# EAGLE design Powerboard (EAGLE 9.3.1)
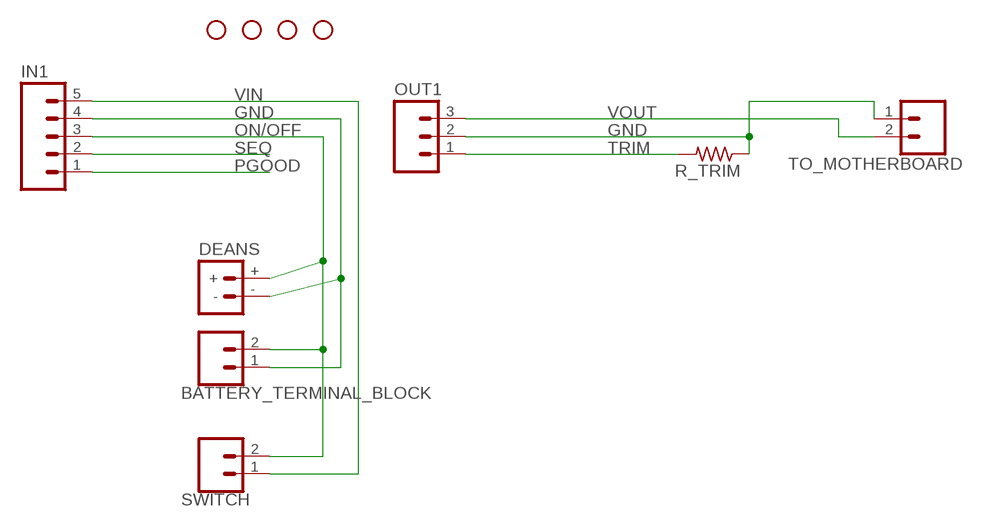
[diagram p0: schematic, sheet 1]

## Parts
BATTERY_TERMINAL_BLOCK  CONN_023.5MM  [SCREWTERMINAL-3.5MM-2]
DEANS  BATTERY_CONN_DEANS  [DEANS]
IN1  M05PTH  [1X05]
OUT1  M03PTH  [1X03]
R_TRIM  R-US_R0603  [R0603]
SWITCH  CONN_023.5MM  [SCREWTERMINAL-3.5MM-2]
TO_MOTHERBOARD  CONN_023.5MM  [SCREWTERMINAL-3.5MM-2]
U$2  STAND-OFF  [STAND-OFF]
U$6  STAND-OFF  [STAND-OFF]
U$7  STAND-OFF  [STAND-OFF]
U$8  STAND-OFF  [STAND-OFF]

## Nets
GND: BATTERY_TERMINAL_BLOCK.1 DEANS.- IN1.4 OUT1.2 R_TRIM.1 TO_MOTHERBOARD.1
ON/OFF: BATTERY_TERMINAL_BLOCK.2 DEANS.+ IN1.3 SWITCH.2
PGOOD: IN1.1
SEQ: IN1.2
TRIM: OUT1.1 R_TRIM.2
VIN: IN1.5 SWITCH.1
VOUT: OUT1.3 TO_MOTHERBOARD.2

## Library data of the parts
BATTERY_TERMINAL_BLOCK SWITCH TO_MOTHERBOARD = SparkFun-Connectors:CONN_02: Multi connection point. Often used as Generic Header-pin footprint for 0.1 inch spaced/style header connections On any of the 0.1 inch spaced packages, you can populate with these: Break Away Headers - Straight <https://www.sparkfun.com/products/116> (PRT-00116) Break Away Male Headers - Right Angle <https://www.sparkfun.com/products/553> (PRT-00553) Female Headers <https://www.sparkfun.com/products/115> (PRT-00115) Break Away Headers - Machine Pin <https://www.sparkfun.com/products/117> (PRT-00117) Break Away Female Headers - Swiss Machine Pin <https://www.sparkfun.com/products/743> (PRT-00743) For SCREWTERMINALS and SPRING TERMINALS visit here: Screw Terimnals on SparkFun.com <https://www.sparkfun.com/search/results?term=Screw+Terminals> (5mm/3.5mm/2.54mm spacing) This device is also useful as a general connection point to wire up your design to another part of your project. Our various solder wires solder well into these plated through hole pads. Hook-Up Wire - Assortment (Stranded, 22 AWG) <https://www.sparkfun.com/products/11375> (PRT-11375) Hook-Up Wire - Assortment (Solid Core, 22 AWG) <https://www.sparkfun.com/products/11367> (PRT-11367) View the entire wire category on our website here <https://www.sparkfun.com/categories/141> Special notes: Molex polarized connector foot print use with: PRT-08233 with associated crimp pins and housings. 2.54_SCREWTERM for use with PRT-10571. 3.5mm Screw Terminal footprints for PRT-08084 5mm Screw Terminal footprints for use with PRT-08432; PROD_ID: CONN-08399
DEANS = SparkFun-Connectors:BATTERY_CONN: Battery Connectors Various footprints for battery connections SparkFun Products: Deans Connector -M/F Pair <https://www.sparkfun.com/products/11864>; SF_ID: PRT-11864
IN1 = SparkFun:M05: Header 5 Standard 5-pin 0.1" header. Use with straight break away headers (SKU : PRT-00116), right angle break away headers (PRT-00553), swiss pins (PRT-00743), machine pins (PRT-00117), and female headers (PRT-00115). Molex polarized connector foot print use with SKU : PRT-08230 with associated crimp pins and housings.
OUT1 = SparkFun:M03: Header 3 Standard 3-pin 0.1" header. Use with straight break away headers (SKU : PRT-00116), right angle break away headers (PRT-00553), swiss pins (PRT-00743), machine pins (PRT-00117), and female headers (PRT-00115). Molex polarized connector foot print use with SKU : PRT-08232 with associated crimp pins and housings.
R_TRIM = rcl:R-US_: RESISTOR, American symbol; SPICEPREFIX: R
U$2 U$6-U$8 = SparkFun:STAND-OFF: Stand Off This is the mechanical footprint for a #4 phillips button head screw. Use the keepout ring to avoid running the screw head into surrounding components. SKU : PRT-00447

## Board
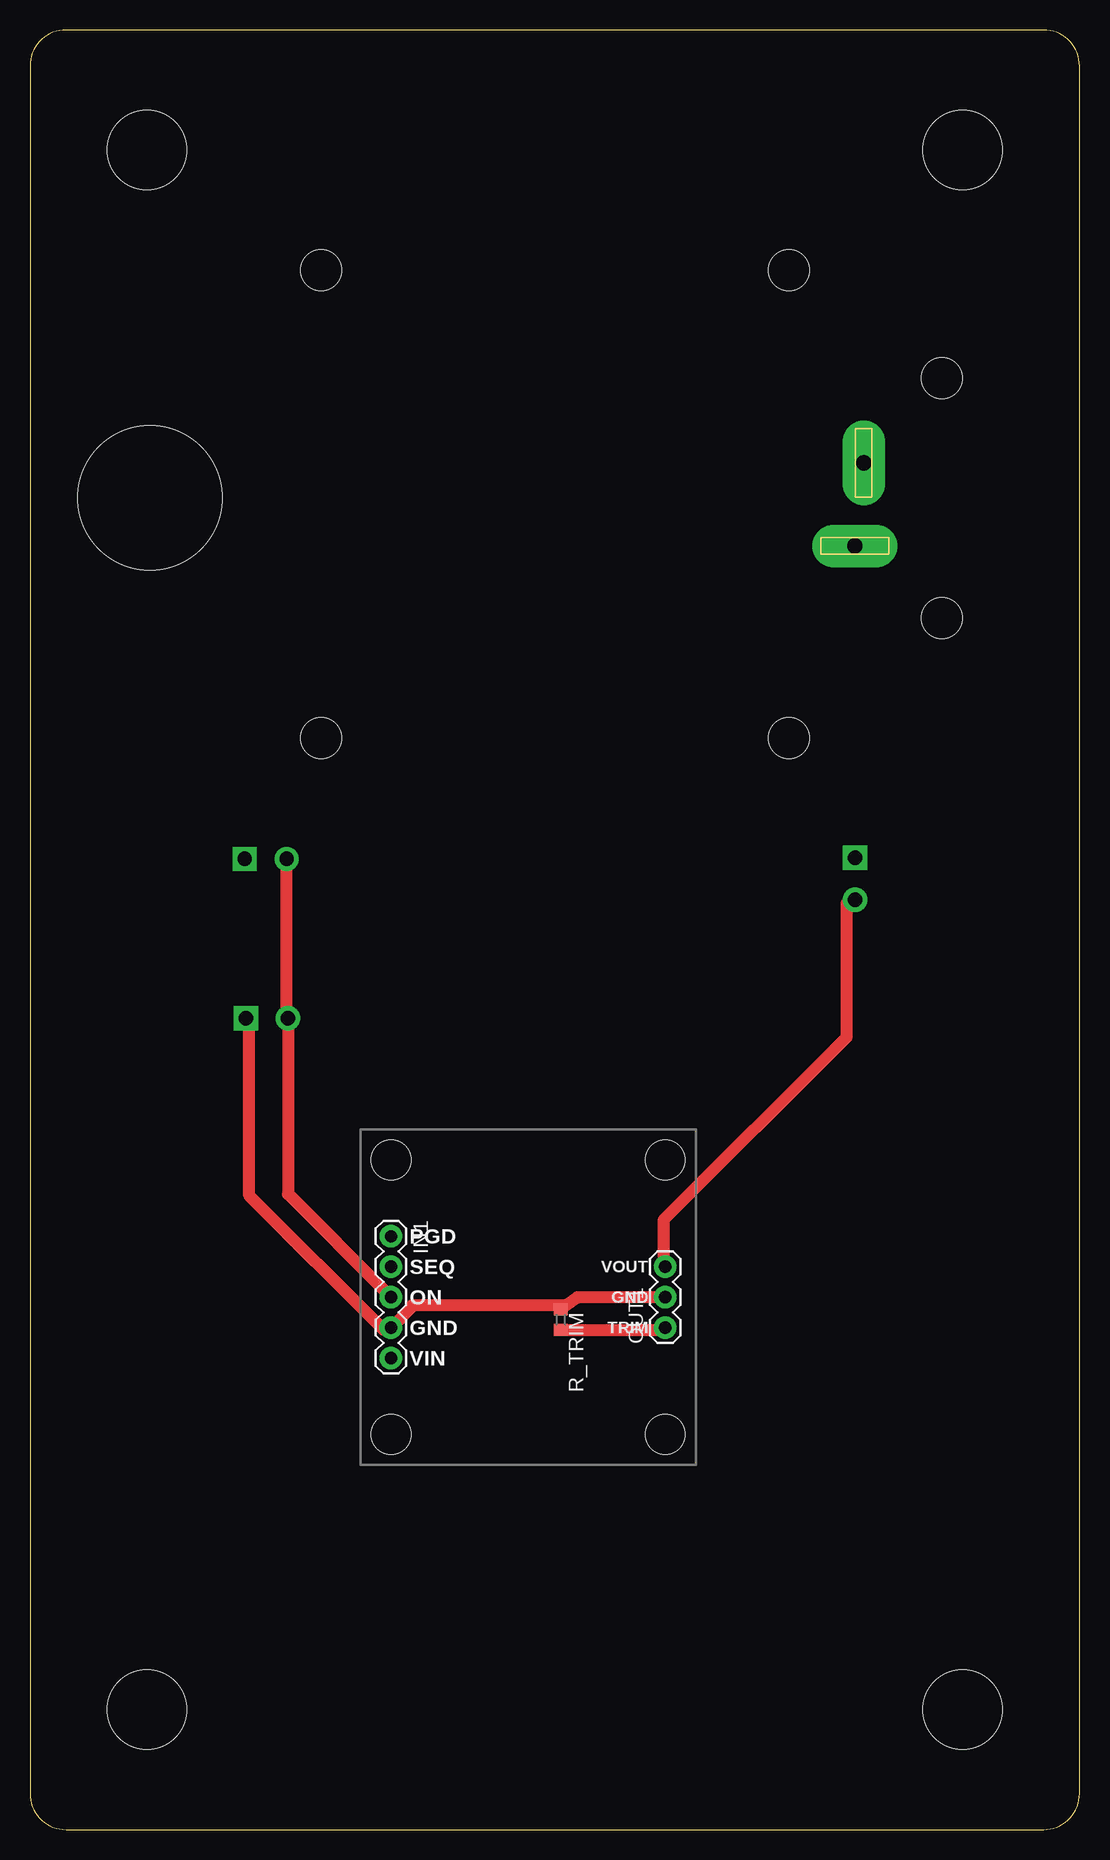
[diagram p1: board, top side]
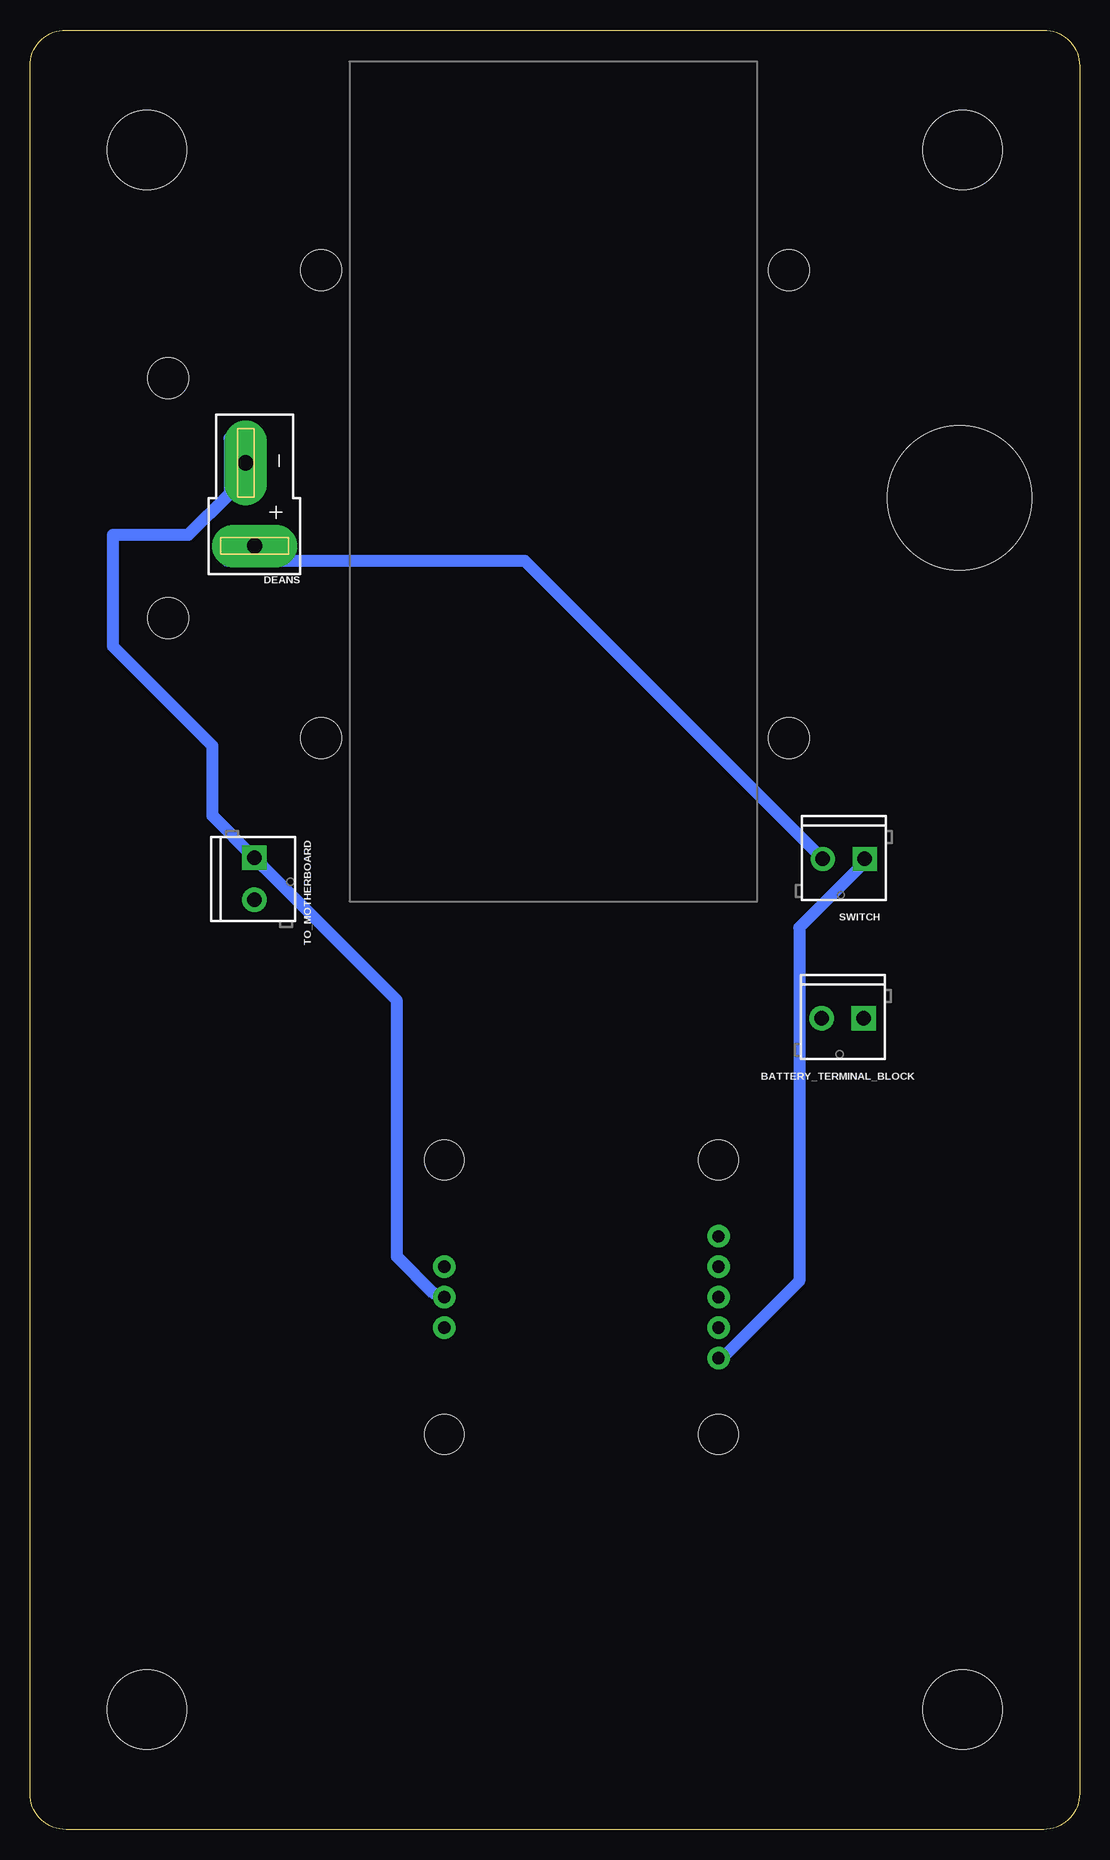
[diagram p2: board, bottom side, seen from below]

Size 87.5 x 150 mm. Coordinates in mm from the lower left corner, seen from the top.
Outline: 3,0 84.5,0 arc90 87.5,3 87.5,147 arc90 84.5,150 3,150 arc90 0,147 0,3 arc90 3,0
Copper layers (1*16): Top 0.035mm / dielectric 1.5mm / Bottom 0.035mm
Design rules "default *": minimum track width 40mil, minimum drill 0.35mm, track to track 40mil, track to pad 6mil, pad to pad 6mil, via to via 6mil, smd to smd 6mil, copper to edge 40mil, drill to drill 40mil, minimum pad ring 10mil, minimum via ring 8mil, stop-mask expansion 4mil, vias tented up to drill 0mil, thermal gap 10mil
Holes 6.6 mm at 9.75,140 9.75,10 77.75,10 77.75,140
Holes 12 mm at 10,111
Holes 3.4 mm at 24.25,130 63.25,130 24.25,91 63.25,91 76,101 76,121
tKeepout: area 4.6,134.9 to 14.9,145.1; area 72.6,134.9 to 82.9,145.1; area 72.6,4.9 to 82.9,15.1; area 4.6,4.9 to 14.9,15.1

### Footprints (pad centres in the part's own frame; a part is rotated, then mirrored left to right if it is on the bottom)
SCREWTERMINAL-3.5MM-2 = drill 1.2 pad 2.032 square: 1 0,0 | drill 1.2 pad 2.032: 2 3.5,0
DEANS = drill 1.27 pad 3.556 long: + 0,0; - 0.737,-6.921
1X05 = drill 1.016 pad 1.88: 1 0,0; 2 2.54,0; 3 5.08,0; 4 7.62,0; 5 10.16,0
1X03 = drill 1.016 pad 1.88: 1 0,0; 2 2.54,0; 3 5.08,0
R0603 = smd 1 x 1.1: 1 -0.85,0; 2 0.85,0
STAND-OFF = hole 3.302: 0,0

### Placement (x,y rotation side)
BATTERY_TERMINAL_BLOCK  18,67.62 180 bottom
DEANS  68.78,107 180 bottom
IN1  30.1,49.45 270 top
OUT1  52.96,41.83 90 top
R_TRIM  44.25,42.5 270 top
SWITCH  17.9,80.9 180 bottom
TO_MOTHERBOARD  68.8,81 270 bottom
U$2  30.1,55.8 270 top
U$6  30.1,32.94 270 top
U$7  52.96,55.8 270 top
U$8  52.96,32.94 270 top

### Tracks (layer width: path | path; a pad name or v marks a point on that pad's centre or on a via)
GND
  Top 1.016: OUT1.2 45.62,44.37 44.7,43.69 | 44.7,43.69 31.89,43.69 31.83,43.56 IN1.4 29.46,41.66 18.29,52.83 18.29,67.06 BATTERY_TERMINAL_BLOCK.1 | 44.7,43.69 R_TRIM.1
  Bottom 1.016: OUT1.2 53.85,44.7 56.9,47.75 56.9,69.09 68.07,80.26 TO_MOTHERBOARD.1 72.31,84.51 72.31,90.34 80.59,98.63 80.59,107.9 74.3,107.9 70.87,111.33 70.87,115.98 70.08,116.76 69.51,116.2 DEANS.-
ON/OFF
  Top 1.016: SWITCH.2 21.34,80.26 21.34,68.07 BATTERY_TERMINAL_BLOCK.2 21.5,52.97 29.71,44.76 | 29.71,44.76 29.73,44.76 | IN1.3 29.71,44.76
  Bottom 1.016: DEANS.+ 69.79,107 71.04,105.75 46.26,105.75 SWITCH.2
TRIM
  Top 1.016: R_TRIM.2 52.78,41.65 OUT1.1
VIN
  Bottom 1.016: IN1.5 29.46,39.62 23.37,45.72 23.37,75.18 18.29,80.26 SWITCH.1
VOUT
  Top 1.016: OUT1.3 52.83,47.75 52.83,50.8 68.07,66.04 68.07,77.22 TO_MOTHERBOARD.2

### Text on the board
tPlace: PGD | VOUT | SEQ | GND | ON | TRIM | GND | VIN
Document: uORocketry | Power Board | v1.0
tDocu: - | +
bDocu: - | +